# Altium schematic sheet diode_rectifier.SchDoc
size A4
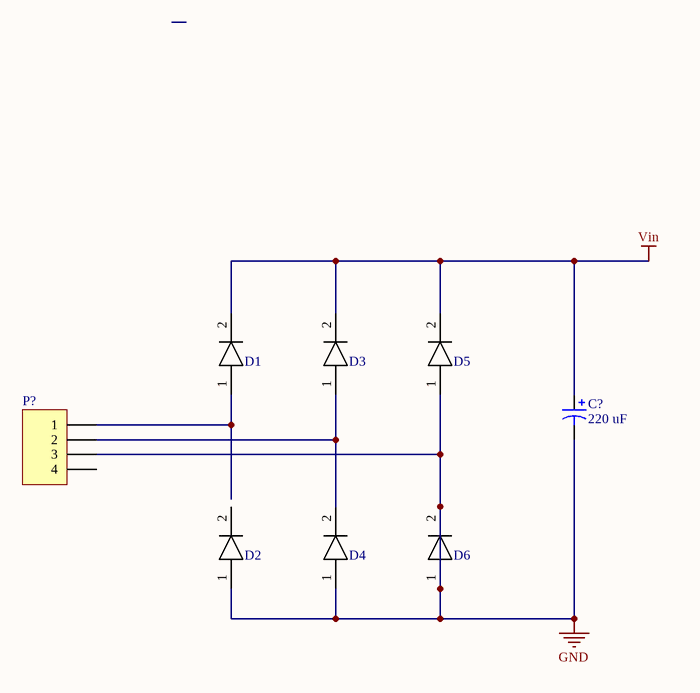
[diagram p0: diode_rectifier.SchDoc]

## Parts
C?  value 220 uF  [CAP-6.3X11]  (hidden comment: UVY1E221MED1TD)
D1  DI S2GTR  [DI S2GTR]  (value not drawn)
D2  DI S2GTR  [DI S2GTR]  (value not drawn)
D3  DI S2GTR  [DI S2GTR]  (value not drawn)
D4  DI S2GTR  [DI S2GTR]  (value not drawn)
D5  DI S2GTR  [DI S2GTR]  (value not drawn)
D6  DI S2GTR  [DI S2GTR]  (value not drawn)
P?  CTB9358/4AO  [CTB9350/4AO]  (value not drawn)

## Nets
GND: C?.2 D2.1(Anode) D4.1(Anode) D5.1(Anode) D6.1(Anode) D6.2(Cathode) P?.3
Vin: C?.1 D1.2(Cathode) D3.2(Cathode) D5.2(Cathode)
NetD1_1: D1.1(Anode) P?.1
NetD3_1: D3.1(Anode) D4.2(Cathode) P?.2

Not connected (* = marked no-connect by the designer): D2 2(Cathode); P? 4

## Library data of the parts
C? = UVY1E221MED1TD: Electrlytic capacitor; Published: 28.10.2015; LatestRevisionDate: -; Publisher: Sinan; PackageDescription: Polarized Capacitor; 2 Leads; Supplier: Digi-Key; Supplier No: 493-12904-1-ND
D1-D6 = DI S2GTR: DI, S2GTR, 400V, 2A
P? = CTB9358/4AO: 4 pos plıggable terminal; LatestRevisionDate: 19.05.2016; Publisher: Sinan